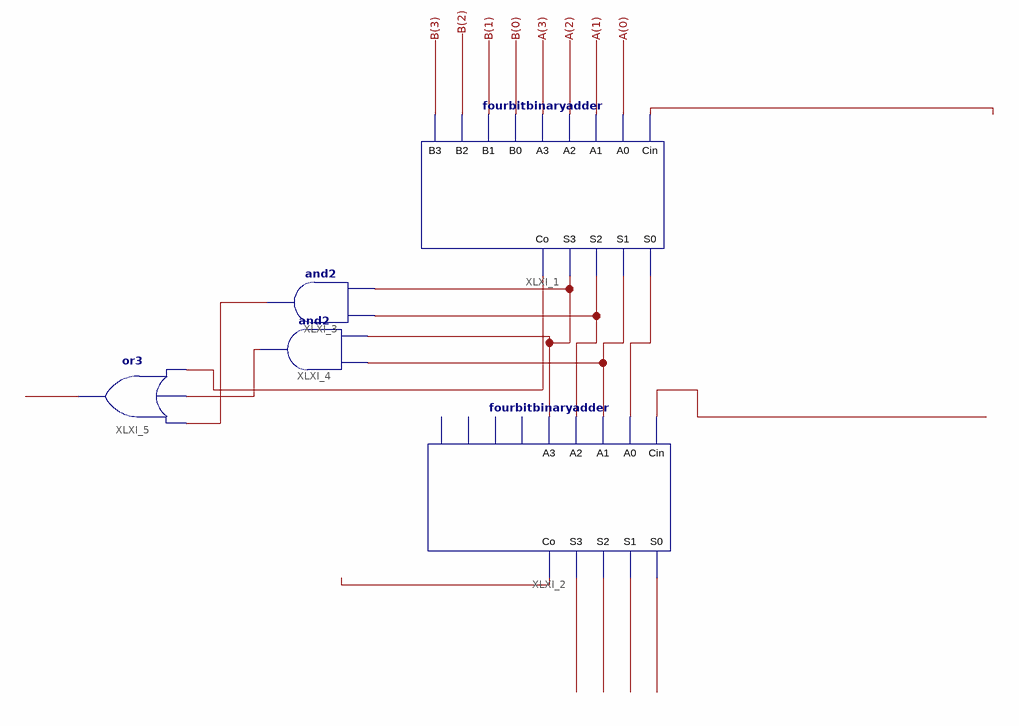
[diagram p0: schematic sheet 1]
// Xilinx ISE schematic ALUBCD.sch (artix7) as structural Verilog: 5 symbols, 0 ports
module ALUBCD (
);

  wire XLXN_1, XLXN_2, XLXN_3, XLXN_4, XLXN_5, XLXN_6, XLXN_7, XLXN_8, XLXN_9, XLXN_21, XLXN_22, XLXN_23,
       XLXN_24, XLXN_25, XLXN_26;
  wire [3:0] A, B;

  fourbitbinaryadder XLXI_1 (
    .A0(A[0]), .B0(B[0]), .A1(A[1]), .B1(B[1]), .B2(B[2]), .A2(A[2]), .A3(A[3]), .B3(B[3]), .Cin(XLXN_1),
    .Co(XLXN_7), .S2(XLXN_5), .S1(XLXN_4), .S3(XLXN_6), .S0(XLXN_3));
  fourbitbinaryadder XLXI_2 (
    .A0(XLXN_3), .A1(XLXN_4), .A2(XLXN_5), .A3(XLXN_6), .Cin(XLXN_2), .Co(XLXN_25), .S2(XLXN_22),
    .S1(XLXN_23), .S3(XLXN_21), .S0(XLXN_24));  // open: B0, B1, B2, B3
  or XLXI_5 (XLXN_26, XLXN_7, XLXN_9, XLXN_8);
  and XLXI_4 (XLXN_9, XLXN_6, XLXN_4);
  and XLXI_3 (XLXN_8, XLXN_6, XLXN_5);
endmodule
